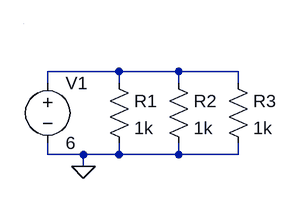
[diagram p0: schematic 3Parallel.asc]
3Parallel.asc, the LTspice schematic file:
Version 4
SHEET 1 880 680
WIRE 128 64 32 64
WIRE 208 64 128 64
WIRE 288 64 208 64
WIRE 32 80 32 64
WIRE 128 80 128 64
WIRE 208 80 208 64
WIRE 288 80 288 64
WIRE 32 176 32 160
WIRE 80 176 32 176
WIRE 128 176 128 160
WIRE 128 176 80 176
WIRE 208 176 208 160
WIRE 208 176 128 176
WIRE 288 176 288 160
WIRE 288 176 208 176
WIRE 80 192 80 176
WIRE 0 0 0 0
FLAG 80 192 0
SYMBOL res 112 64 R0
SYMATTR InstName R1
SYMATTR Value 1k
SYMBOL res 192 64 R0
SYMATTR InstName R2
SYMATTR Value 1k
SYMBOL res 272 64 R0
SYMATTR InstName R3
SYMATTR Value 1k
SYMBOL voltage 32 64 R0
SYMATTR InstName V1
SYMATTR Value 6

The netlist it stands for:
* 3Parallel.asc
R1 N001 0 1k
R2 N001 0 1k
R3 N001 0 1k
V1 N001 0 6
.backanno
.end